# EAGLE design pro2310 (EAGLE 7.4.0)

## Sheet 1 of 6
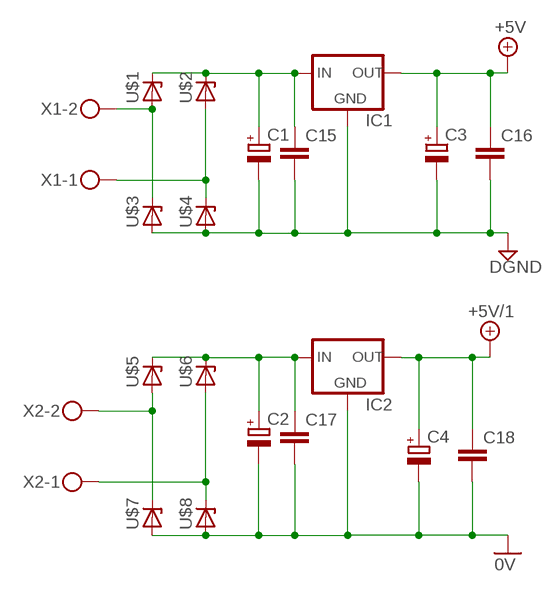
[diagram p0: schematic, sheet 1]

### Parts
C1  CPOL-EUE5-10.5  [E5-10,5]
C2  CPOL-EUE5-10.5  [E5-10,5]
C3  CPOL-EUE3.5-8  [E3,5-8]
C4  CPOL-EUE3.5-8  [E3,5-8]
C15  C-EU050-055X075  [C050-055X075]
C16  C-EU050-055X075  [C050-055X075]
C17  C-EU050-055X075  [C050-055X075]
C18  C-EU050-055X075  [C050-055X075]
IC1  78LXX  [78LXX]
IC2  78MXXL  [78MXXL]
U$1  1N4148-V  [1N4148]
U$2  1N4148-V  [1N4148]
U$3  1N4148-V  [1N4148]
U$4  1N4148-V  [1N4148]
U$5  1N4148-V  [1N4148]
U$6  1N4148-V  [1N4148]
U$7  1N4148-V  [1N4148]
U$8  1N4148-V  [1N4148]
X1  MKDSN1,5/2-5,08  [MKDSN1,5/2-5,08]
X2  MKDSN1,5/2-5,08  [MKDSN1,5/2-5,08]

### Nets
0V: C2.- C4.- C17.2 C18.2 IC2.GND U$7.A U$8.A ; also sheet 2,4,6
+5V: C3.+ C16.1 IC1.OUT ; also sheet 3
+5V/1: C4.+ C18.1 IC2.OUT ; also sheet 2
DGND: C1.- C3.- C15.2 C16.2 IC1.GND U$3.A U$4.A ; also sheet 2,3
N$5: C1.+ C15.1 IC1.IN U$1.C U$2.C
N$6: U$5.A U$7.C X2.2
N$7: U$6.A U$8.C X2.1
N$8: U$2.A U$4.C X1.1
N$9: C2.+ C17.1 IC2.IN U$5.C U$6.C
N$10: U$1.A U$3.C X1.2

## Sheet 2 of 6
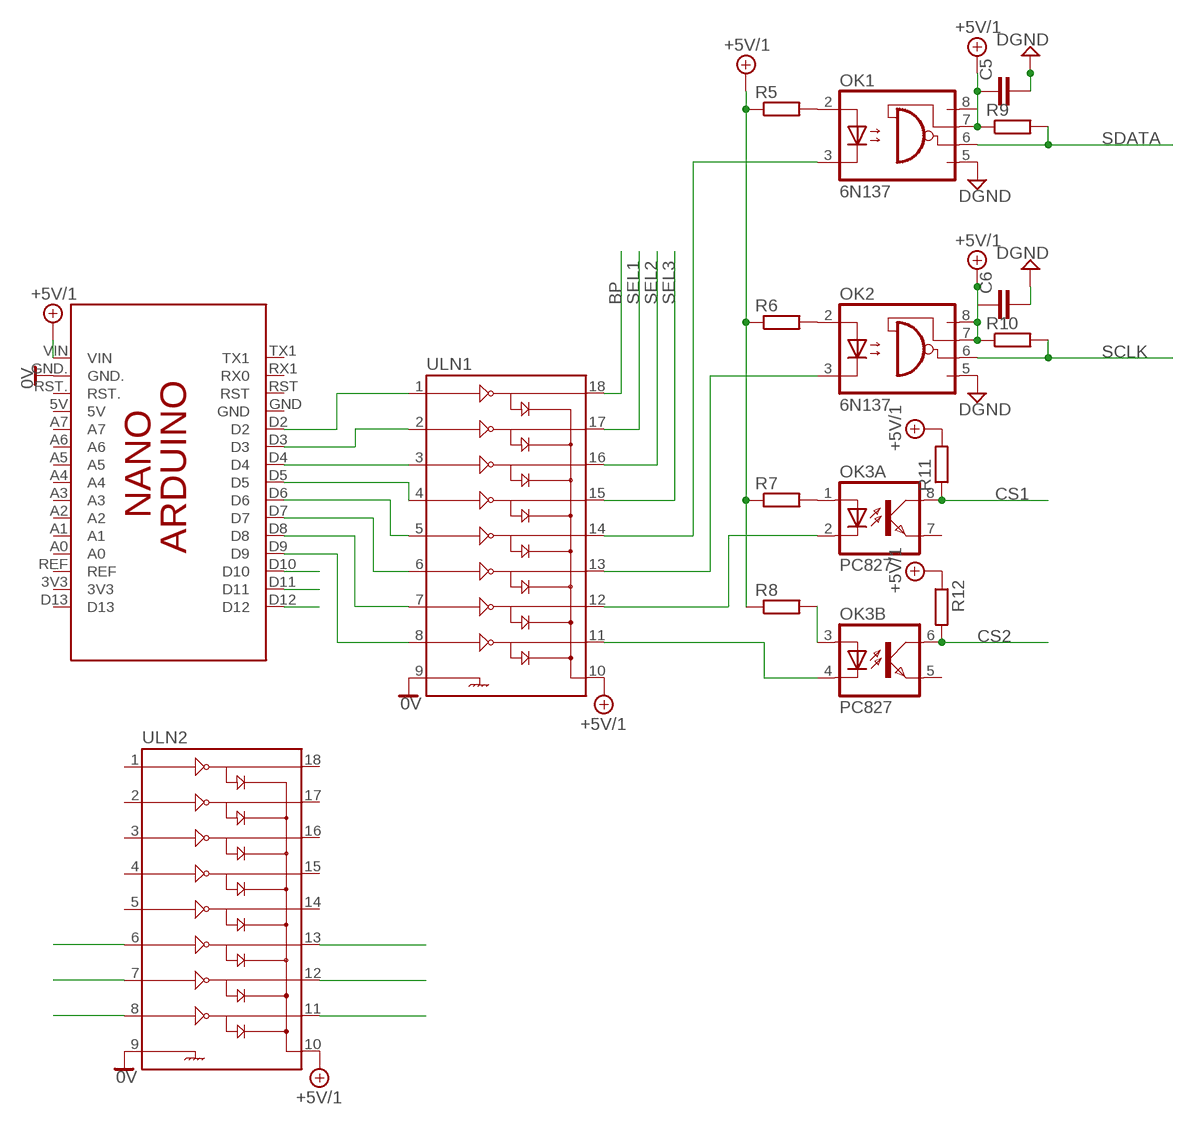
[diagram p1: schematic, sheet 2]

### Parts
C5  C-EU025-025X050  [C025-025X050]
C6  C-EU025-025X050  [C025-025X050]
OK1  6N137  [DIL08]
OK2  6N137  [DIL08]
OK3  PC827  [DIL08]
PCB1  ARDUINO_NANO  [ARDUINO_NANO]
R5  R-EU_0207/2V  [0207/2V]
R6  R-EU_0207/2V  [0207/2V]
R7  R-EU_0207/2V  [0207/2V]
R8  R-EU_0207/2V  [0207/2V]
R9  R-EU_0207/2V  [0207/2V]
R10  R-EU_0207/2V  [0207/2V]
R11  R-EU_0207/2V  [0207/2V]
R12  R-EU_0207/2V  [0207/2V]
ULN1  ULN2803DIP  [DIL18]
ULN2  ULN2803DIP  [DIL18]

### Nets
0V: PCB1.GND. ULN1.9 ULN2.9 ; also sheet 1,4,6
+5V/1: C5.1 C6.1 OK1.7(VE) OK1.8(VCC) OK2.7(VE) OK2.8(VCC) PCB1.VIN R5.1 R6.1 R7.1 R8.1 R9.1 R10.1 R11.2 R12.1 ULN1.10 ULN2.10 ; also sheet 1
BP: ULN1.18 ; also sheet 4
CS1: OK3.8(A:COL) R11.1 ; also sheet 3
CS2: OK3.6(B:COL) R12.2 ; also sheet 3
D2: PCB1.D2 ULN1.1
D3: PCB1.D3 ULN1.2
D4: PCB1.D4 ULN1.3
D5: PCB1.D5 ULN1.4
D6: PCB1.D6 ULN1.5
D7: PCB1.D7 ULN1.6
D8: PCB1.D8 ULN1.7
D9: PCB1.D9 ULN1.8
D10: PCB1.D10 ULN2.8
D11: PCB1.D11 ULN2.7
D12: PCB1.D12 ULN2.6
DGND: C5.2 C6.2 OK1.5(GND) OK2.5(GND) ; also sheet 1,3
N$17: OK1.2(A) R5.2
N$18: OK2.2(A) R6.2
N$19: OK3.1(A:A) R7.2
N$20: OK3.3(B:A) R8.2
N$21: OK1.3(C) ULN1.14
N$22: OK3.2(A:C) ULN1.12
N$23: OK3.4(B:C) ULN1.11
N$25: OK2.3(C) ULN1.13
OUT1: ULN2.13 ; also sheet 6
OUT2: ULN2.12 ; also sheet 6
OUT3: ULN2.11 ; also sheet 6
SCLK: OK2.6(VO) R10.2 ; also sheet 3
SDATA: OK1.6(VO) R9.2 ; also sheet 3
SEL1: ULN1.17 ; also sheet 4
SEL2: ULN1.16 ; also sheet 4
SEL3: ULN1.15 ; also sheet 4
Unconnected: OK3.5(B:EMIT) OK3.7(A:EMIT) PCB1.3V3 PCB1.5V PCB1.A0 PCB1.A1 PCB1.A2 PCB1.A3 PCB1.A4 PCB1.A5 PCB1.A6 PCB1.A7 PCB1.D13 PCB1.GND PCB1.REF PCB1.RST PCB1.RST. PCB1.RX1(RX0) PCB1.TX1 ULN2.1 ULN2.2 ULN2.3 ULN2.4 ULN2.5 ULN2.14 ULN2.15 ULN2.16 ULN2.17 ULN2.18

## Sheet 3 of 6
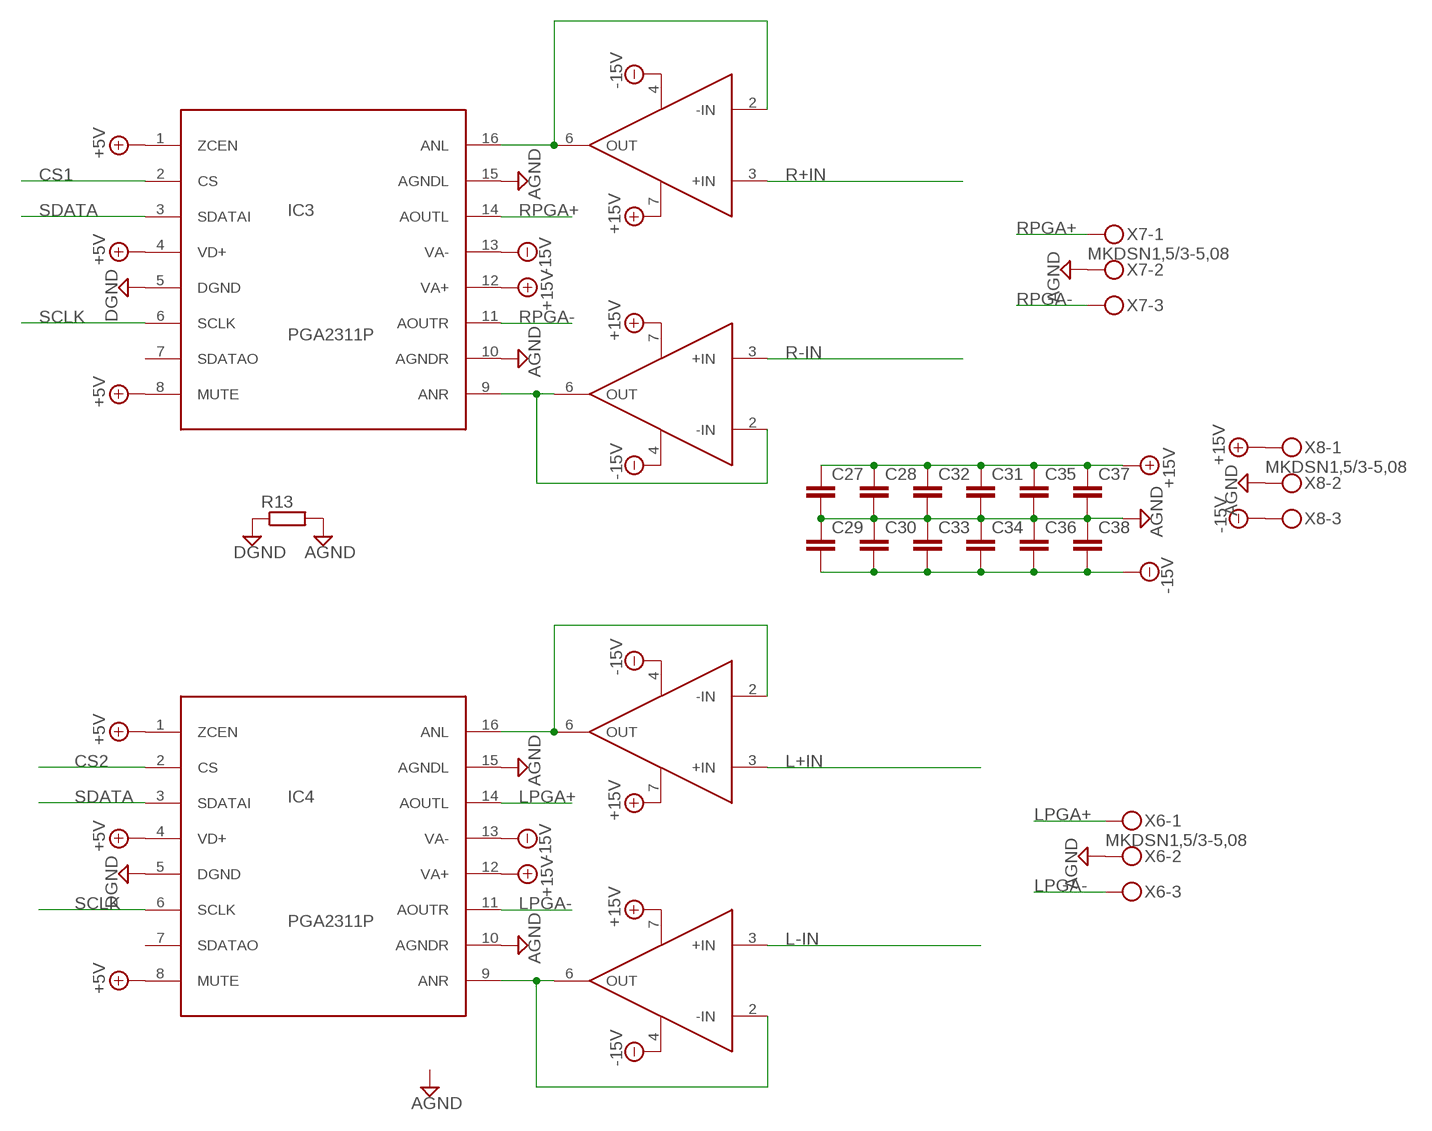
[diagram p2: schematic, sheet 3]

### Parts
C27  C-EU025-025X050  [C025-025X050]
C28  C-EU025-025X050  [C025-025X050]
C29  C-EU025-025X050  [C025-025X050]
C30  C-EU025-025X050  [C025-025X050]
C31  C-EU025-025X050  [C025-025X050]
C32  C-EU025-025X050  [C025-025X050]
C33  C-EU025-025X050  [C025-025X050]
C34  C-EU025-025X050  [C025-025X050]
C35  C-EU025-025X050  [C025-025X050]
C36  C-EU025-025X050  [C025-025X050]
C37  C-EU025-025X050  [C025-025X050]
C38  C-EU025-025X050  [C025-025X050]
IC3  PGA2311P  [DIL16]
IC4  PGA2311P  [DIL16]
R13  R-EU_0207/7  [0207/7]
U1  OPA627BP  [DIL08]
U2  OPA627BP  [DIL08]
U3  OPA627BP  [DIL08]
U4  OPA627BP  [DIL08]
X6  MKDSN1,5/3-5,08  [MKDSN1,5/3-5,08]
X7  MKDSN1,5/3-5,08  [MKDSN1,5/3-5,08]
X8  MKDSN1,5/3-5,08  [MKDSN1,5/3-5,08]

### Nets
+5V: IC3.1(ZCEN) IC3.4(VD+) IC3.8(MUTE) IC4.1(ZCEN) IC4.4(VD+) IC4.8(MUTE) ; also sheet 1
+15V: C27.1 C28.1 C31.1 C32.1 C35.1 C37.1 IC3.12(VA+) IC4.12(VA+) U1.7(V+) U2.7(V+) U3.7(V+) U4.7(V+) X8.1
-15V: C29.2 C30.2 C33.2 C34.2 C36.2 C38.2 IC3.13(VA-) IC4.13(VA-) U1.4(V-) U2.4(V-) U3.4(V-) U4.4(V-) X8.3
AGND: C27.2 C28.2 C29.1 C30.1 C31.2 C32.2 C33.1 C34.1 C35.2 C36.1 C37.2 C38.1 IC3.10(AGNDR) IC3.15(AGNDL) IC4.10(AGNDR) IC4.15(AGNDL) R13.2 X6.2 X7.2 X8.2 ; also sheet 4
CS1: IC3.2(CS) ; also sheet 2
CS2: IC4.2(CS) ; also sheet 2
DGND: IC3.5(DGND) IC4.5(DGND) R13.1 ; also sheet 1,2
L+IN: U3.3(+IN) ; also sheet 4
L-IN: U4.3(+IN) ; also sheet 4
LPGA+: IC4.14(AOUTL) X6.1 ; also sheet 4
LPGA-: IC4.11(AOUTR) X6.3 ; also sheet 4
N$1: IC3.9(ANR) U2.2(-IN) U2.6(OUT)
N$2: IC3.16(ANL) U1.2(-IN) U1.6(OUT)
N$3: IC4.9(ANR) U4.2(-IN) U4.6(OUT)
N$15: IC4.16(ANL) U3.2(-IN) U3.6(OUT)
R+IN: U1.3(+IN) ; also sheet 4
R-IN: U2.3(+IN) ; also sheet 4
RPGA+: IC3.14(AOUTL) X7.1 ; also sheet 4
RPGA-: IC3.11(AOUTR) X7.3 ; also sheet 4
SCLK: IC3.6(SCLK) IC4.6(SCLK) ; also sheet 2
SDATA: IC3.3(SDATAI) IC4.3(SDATAI) ; also sheet 2
Unconnected: IC3.7(SDATAO) IC4.7(SDATAO)

## Sheet 4 of 6
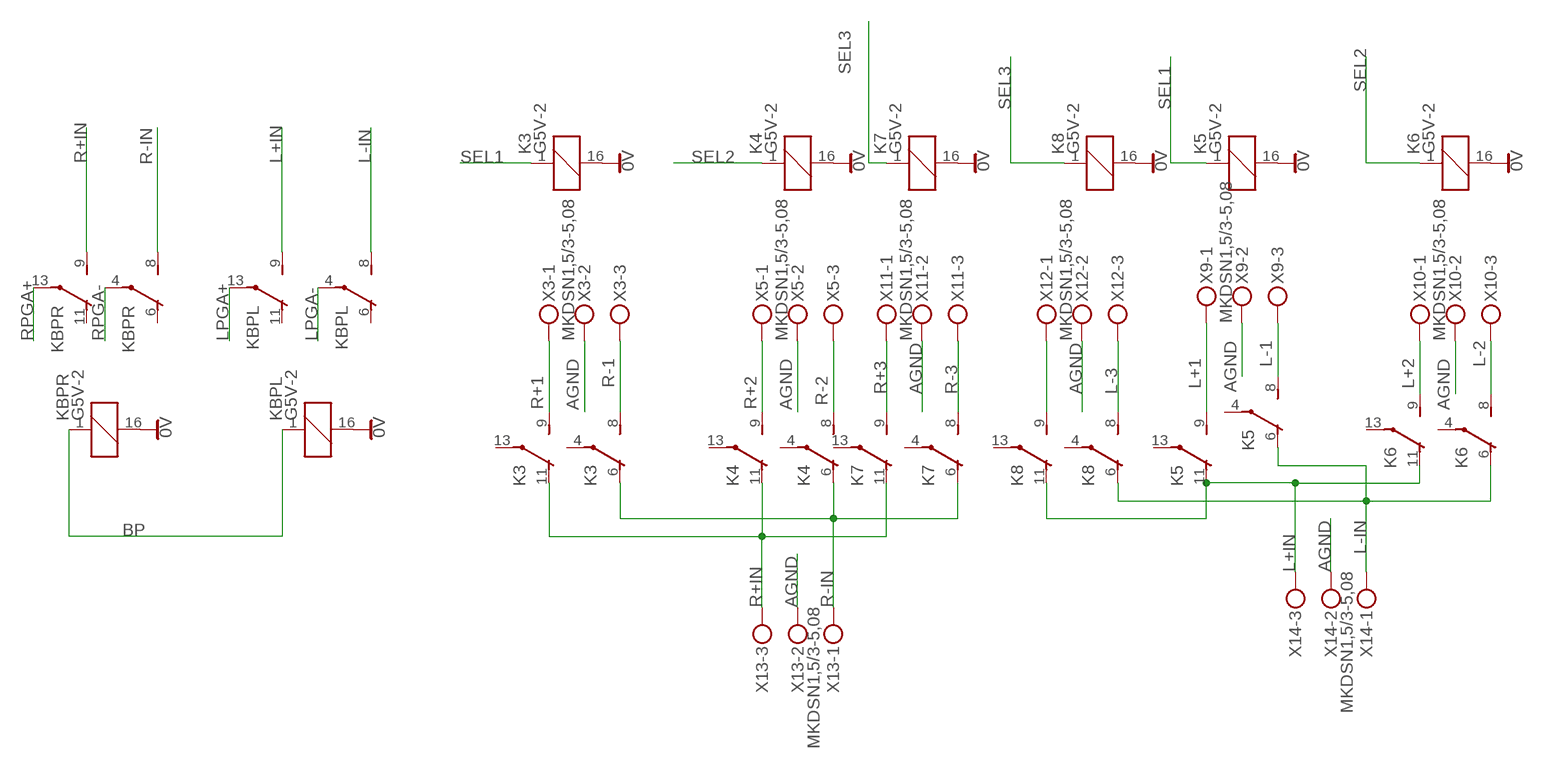
[diagram p3: schematic, sheet 4]

### Parts
K3  G5V-2  [G5V-2]
K4  G5V-2  [G5V-2]
K5  G5V-2  [G5V-2]
K6  G5V-2  [G5V-2]
K7  G5V-2  [G5V-2]
K8  G5V-2  [G5V-2]
KBPL  G5V-2  [G5V-2]
KBPR  G5V-2  [G5V-2]
X3  MKDSN1,5/3-5,08  [MKDSN1,5/3-5,08]
X5  MKDSN1,5/3-5,08  [MKDSN1,5/3-5,08]
X9  MKDSN1,5/3-5,08  [MKDSN1,5/3-5,08]
X10  MKDSN1,5/3-5,08  [MKDSN1,5/3-5,08]
X11  MKDSN1,5/3-5,08  [MKDSN1,5/3-5,08]
X12  MKDSN1,5/3-5,08  [MKDSN1,5/3-5,08]
X13  MKDSN1,5/3-5,08  [MKDSN1,5/3-5,08]
X14  MKDSN1,5/3-5,08  [MKDSN1,5/3-5,08]

### Nets
0V: K3.16 K4.16 K5.16 K6.16 K7.16 K8.16 KBPL.16 KBPR.16 ; also sheet 1,2,6
AGND: X3.2 X5.2 X9.2 X10.2 X11.2 X12.2 X13.2 X14.2 ; also sheet 3
BP: KBPL.1 KBPR.1 ; also sheet 2
L+1: K5.9(2:S) X9.1
L+2: K6.9(2:S) X10.1
L+3: K8.9(2:S) X12.1
L+IN: K5.11(2:O) K6.11(2:O) K8.11(2:O) KBPL.9(2:S) X14.3 ; also sheet 3
L-1: K5.8(1:S) X9.3
L-2: K6.8(1:S) X10.3
L-3: K8.8(1:S) X12.3
L-IN: K5.6(1:O) K6.6(1:O) K8.6(1:O) KBPL.8(1:S) X14.1 ; also sheet 3
LPGA+: KBPL.13(2:P) ; also sheet 3
LPGA-: KBPL.4(1:P) ; also sheet 3
R+1: K3.9(2:S) X3.1
R+2: K4.9(2:S) X5.1
R+3: K7.9(2:S) X11.1
R+IN: K3.11(2:O) K4.11(2:O) K7.11(2:O) KBPR.9(2:S) X13.3 ; also sheet 3
R-1: K3.8(1:S) X3.3
R-2: K4.8(1:S) X5.3
R-3: K7.8(1:S) X11.3
R-IN: K3.6(1:O) K4.6(1:O) K7.6(1:O) KBPR.8(1:S) X13.1 ; also sheet 3
RPGA+: KBPR.13(2:P) ; also sheet 3
RPGA-: KBPR.4(1:P) ; also sheet 3
SEL1: K3.1 K5.1 ; also sheet 2
SEL2: K4.1 K6.1 ; also sheet 2
SEL3: K7.1 K8.1 ; also sheet 2
Unconnected: K3.4(1:P) K3.13(2:P) K4.4(1:P) K4.13(2:P) K5.4(1:P) K5.13(2:P) K6.4(1:P) K6.13(2:P) K7.4(1:P) K7.13(2:P) K8.4(1:P) K8.13(2:P) KBPL.6(1:O) KBPL.11(2:O) KBPR.6(1:O) KBPR.11(2:O)

## Sheet 5 of 6
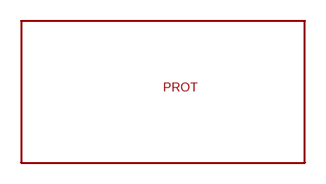
[diagram p4: schematic, sheet 5]

### Parts
U$15  PROT  [PROT]

## Sheet 6 of 6
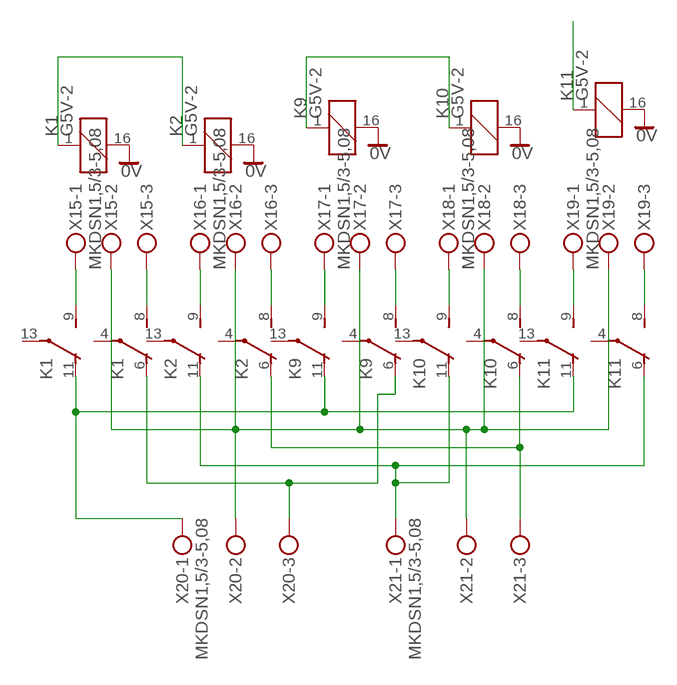
[diagram p5: schematic, sheet 6]

### Parts
K1  G5V-2  [G5V-2]
K2  G5V-2  [G5V-2]
K9  G5V-2  [G5V-2]
K10  G5V-2  [G5V-2]
K11  G5V-2  [G5V-2]
X15  MKDSN1,5/3-5,08  [MKDSN1,5/3-5,08]
X16  MKDSN1,5/3-5,08  [MKDSN1,5/3-5,08]
X17  MKDSN1,5/3-5,08  [MKDSN1,5/3-5,08]
X18  MKDSN1,5/3-5,08  [MKDSN1,5/3-5,08]
X19  MKDSN1,5/3-5,08  [MKDSN1,5/3-5,08]
X20  MKDSN1,5/3-5,08  [MKDSN1,5/3-5,08]
X21  MKDSN1,5/3-5,08  [MKDSN1,5/3-5,08]

### Nets
0V: K1.16 K2.16 K9.16 K10.16 K11.16 ; also sheet 1,2,4
GOUT: X15.2 X16.2 X17.2 X18.2 X19.2 X20.2 X21.2
LOUT+: K2.11(2:O) K10.11(2:O) K11.6(1:O) X21.1
LOUT-: K2.6(1:O) K10.6(1:O) X21.3
N$24: K1.8(1:S) X15.3
N$26: K1.9(2:S) X15.1
N$27: K2.9(2:S) X16.1
N$28: K2.8(1:S) X16.3
N$29: K9.9(2:S) X17.1
N$30: K9.8(1:S) X17.3
N$31: K10.9(2:S) X18.1
N$32: K10.8(1:S) X18.3
N$33: K11.9(2:S) X19.1
N$34: K11.8(1:S) X19.3
OUT1: K1.1 K2.1 ; also sheet 2
OUT2: K9.1 K10.1 ; also sheet 2
OUT3: K11.1 ; also sheet 2
ROUT+: K1.11(2:O) K9.11(2:O) K11.11(2:O) X20.1
ROUT-: K1.6(1:O) K9.6(1:O) X20.3
Unconnected: K1.4(1:P) K1.13(2:P) K2.4(1:P) K2.13(2:P) K9.4(1:P) K9.13(2:P) K10.4(1:P) K10.13(2:P) K11.4(1:P) K11.13(2:P)

## Library data of the parts
C1-C4 = Vwvwbg:CPOL-EU: POLARIZED CAPACITOR, European symbol
C5 C6 C15-C18 C27-C38 = Vwvwbg:C-EU: CAPACITOR, European symbol
IC1 = v-reg:78LXX: VOLTAGE REGULATOR
IC2 = v-reg:78MXXL: VOLTAGE REGULATOR
IC3 IC4 = Vwvwbg:PGA2311
K1-K11 KBPL KBPR = relay:G5V-2: OMRON PCB Relay Source: http://www.omron.com/ecb/products/pdf/en-g5v2.pdf; MPN: G5V-2 5DC; OC_FARNELL: 9949488; OC_NEWARK: 78K5703
OK1 OK2 = optocoupler:6N137: MOTOROLA OPTO COUPLER; MPN: 6N137; OC_FARNELL: 1328376; OC_NEWARK: 52M1895
OK3 = optocoupler:PC827: SHARP OPTO COUPLER; OC_FARNELL: unknown; OC_NEWARK: unknown
PCB1 = E14_Arduino_revB:ARDUINO_NANO: Device for representing an Arduino Nano board with a footprint in an EAGLE design. Created by Dave Young for Element14. More EAGLE documentation at: http://www.element14.com/community/community/knode/cadsoft_eagle
R5-R13 = Vwvwbg:R-EU_: RESISTOR, European symbol
U1-U4 = Vwvwbg:OPA627BP: OPERATIONAL AMPLIFIER
U$1-U$8 = diode:1N4148-V
U$15 = Vwvwbg:PROT
ULN1 ULN2 = SparkFun-PowerIC:ULN2803: Darlington Driver ULN2803 Darlington array. 500mA max per channel, 8-channel package. Spark Fun Electronics SKU : COM-00312
X1 X2 = con-phoenix-508:MKDSN1,5/2-5,08: MKDSN 1,5/ 2-5,08 Printklemme Nennstrom: 13,5 A Nennspannung: 250 V Rastermaß: 5,08 mm Polzahl: 2 Anschlussart: Schraubanschluss Montage: Löten Anschlussrichtung Leiter/Platine: 0 ° Artikelnummer: 1729128 Source: http://eshop.phoenixcontact.com .. 1729128.pdf
X3 X5-X21 = con-phoenix-508:MKDSN1,5/3-5,08: MKDSN 1,5/ 3-5,08 Printklemme Nennstrom: 13,5 A Nennspannung: 250 V Rastermaß: 5,08 mm Polzahl: 3 Anschlussart: Schraubanschluss Montage: Löten Anschlussrichtung Leiter/Platine: 0 ° Artikelnummer: 1729131 Source: http://eshop.phoenixcontact.com .. 1729131.pdf

## Board
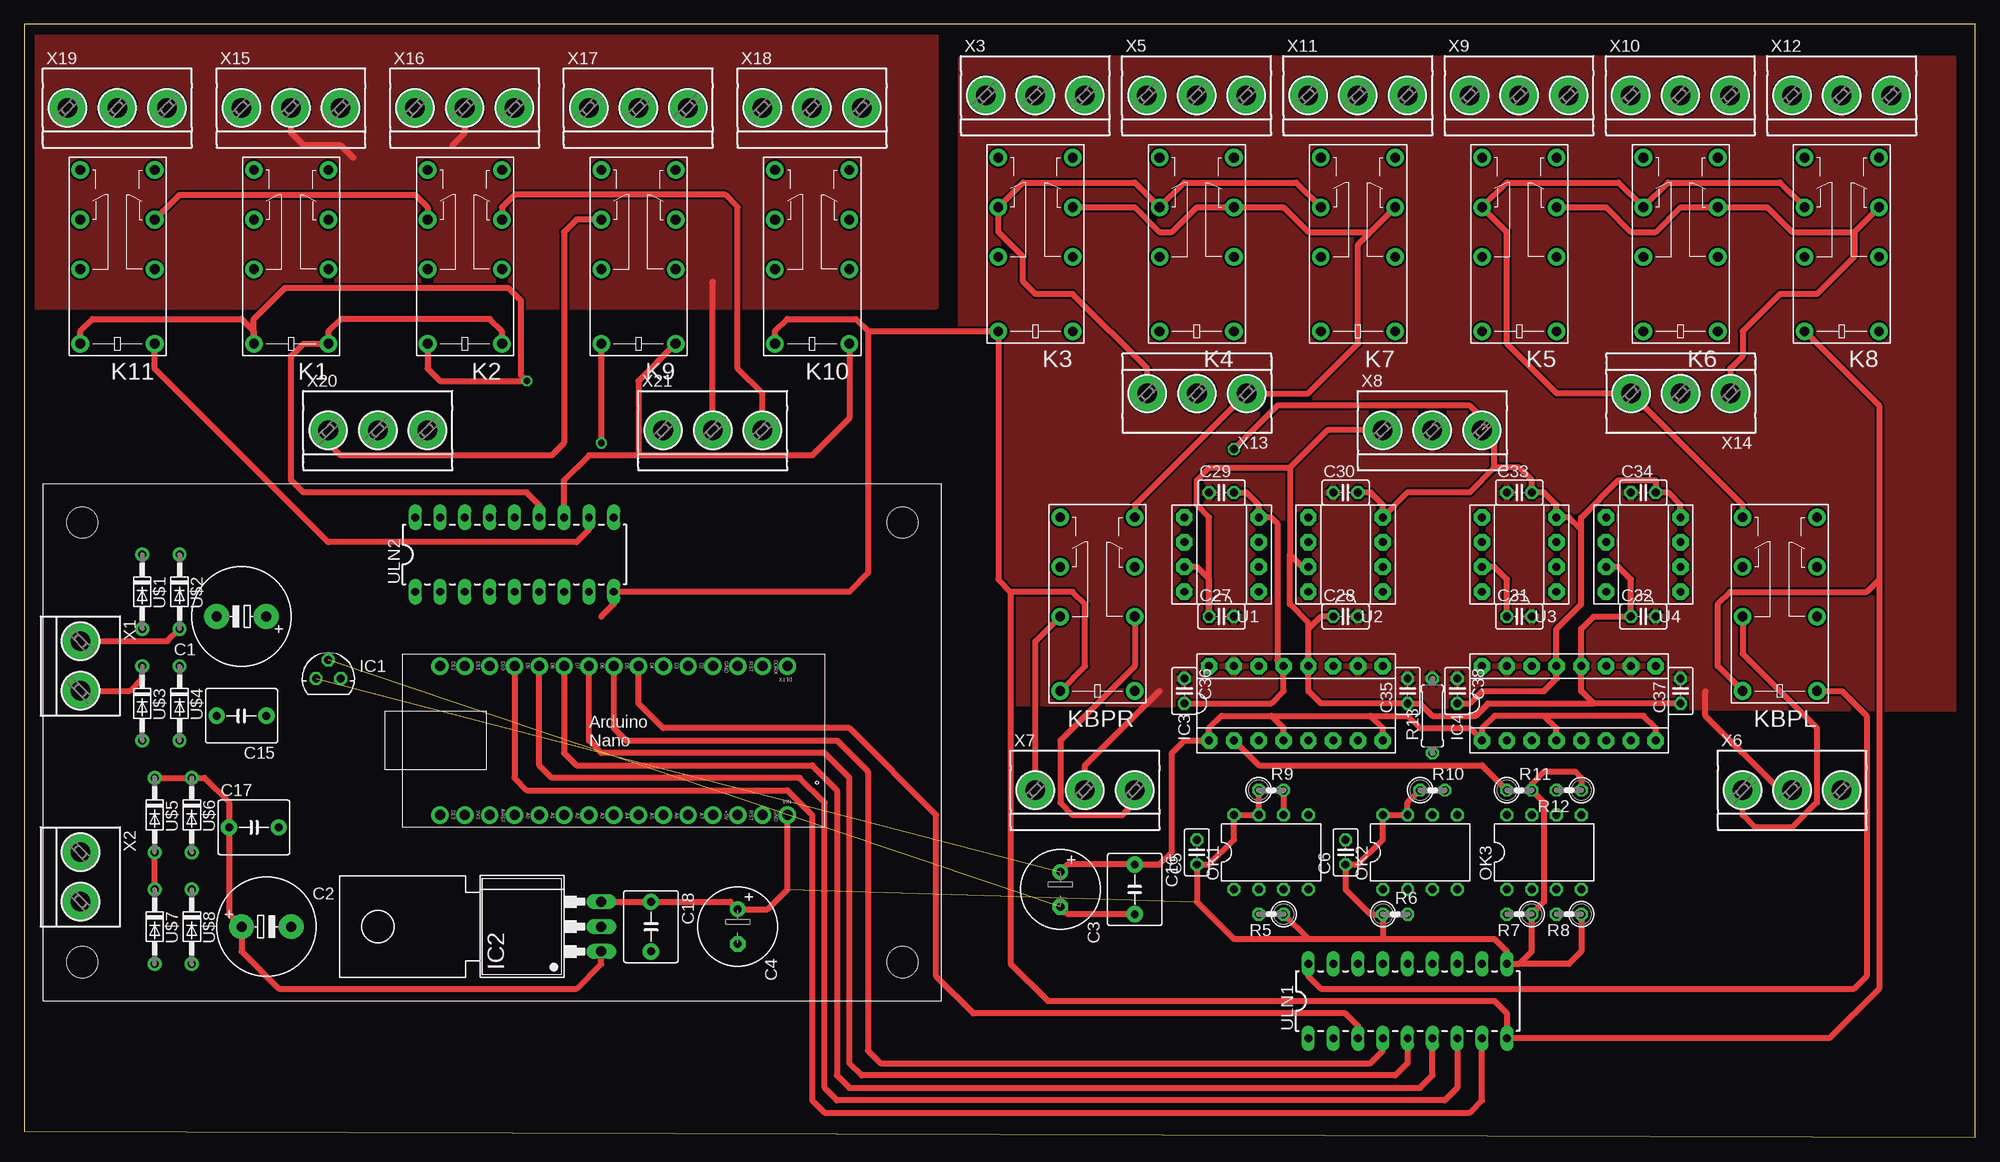
[diagram p6: board, top side]
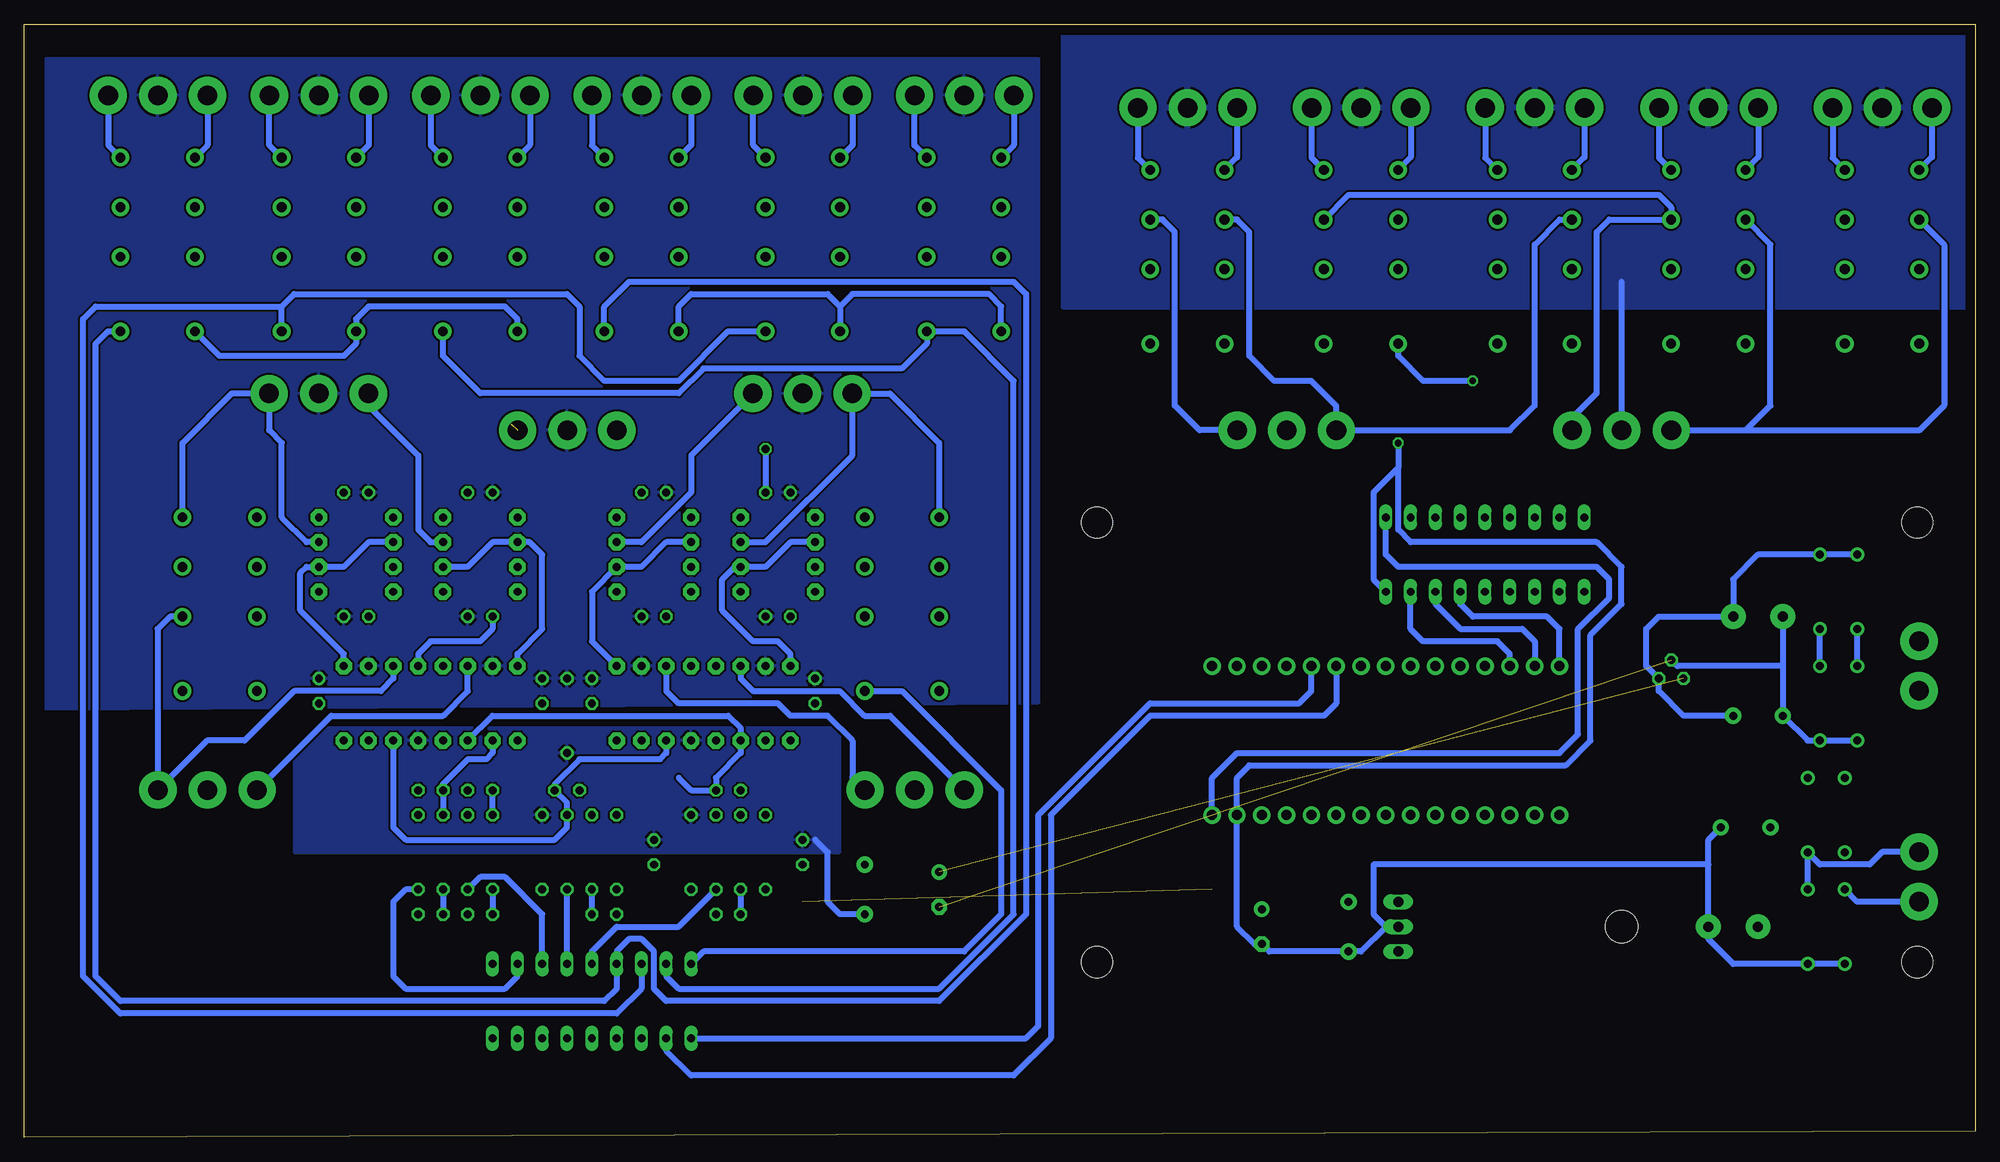
[diagram p7: board, bottom side, seen from below]

Size 199.69 x 113.97 mm. Coordinates in mm from the lower left corner, seen from the top.
Outline: 0,0.64 199.69,0 199.69,113.97 0,113.97 0,0.64
Copper layers (1*16): Top 0.035mm / dielectric 1.5mm / Bottom 0.035mm
Design rules "default": minimum track width 10mil, minimum drill 24mil, track to track 8mil, track to pad 8mil, pad to pad 8mil, via to via 8mil, smd to smd 8mil, copper to edge 40mil, drill to drill 8mil, minimum pad ring 10mil, minimum via ring 8mil, stop-mask expansion 4mil, vias tented up to drill 0mil, thermal gap 10mil

### Footprints (pad centres in the part's own frame; a part is rotated, then mirrored left to right if it is on the bottom)
E5-10,5 = drill 1.016 pad 2.54: + -2.54,0; - 2.54,0
E3,5-8 = drill 0.813 pad 1.6: + -1.778,0 | drill 0.813 pad 1.6 octagon: - 1.778,0
C025-025X050 = drill 0.813 octagon: 1 -1.27,0; 2 1.27,0
C050-055X075 = drill 0.813 pad 1.676: 1 -2.54,0; 2 2.54,0
78LXX = drill 0.813 octagon: GND 0,1.905; IN 1.27,0; OUT -1.27,0
78MXXL = drill 1.016 long: GND 0,-5.08; IN -2.54,-5.08; OUT 2.54,-5.08 | hole 3.302: 0,17.78
DIL16 = drill 0.813 pad 1.676 octagon: 1 -8.89,-3.81; 2 -6.35,-3.81; 3 -3.81,-3.81; 4 -1.27,-3.81; 5 1.27,-3.81; 6 3.81,-3.81; 7 6.35,-3.81; 8 8.89,-3.81; 9 8.89,3.81; 10 6.35,3.81; 11 3.81,3.81; 12 1.27,3.81; 13 -1.27,3.81; 14 -3.81,3.81; 15 -6.35,3.81; 16 -8.89,3.81
G5V-2 = drill 1 pad 1.8: 1 -8.89,-3.81; 4 -1.27,-3.81; 6 3.81,-3.81; 8 8.89,-3.81; 9 8.89,3.81; 11 3.81,3.81; 13 -1.27,3.81; 16 -8.89,3.81
DIL08 = drill 0.813 octagon: 1 -3.81,-3.81; 2 -1.27,-3.81; 3 1.27,-3.81; 4 3.81,-3.81; 5 3.81,3.81; 6 1.27,3.81; 7 -1.27,3.81; 8 -3.81,3.81
ARDUINO_NANO = drill 1.016 pad 1.778: 3V3 6.35,1.27; 5V 31.75,1.27; A0 11.43,1.27; A1 13.97,1.27; A2 16.51,1.27; A3 19.05,1.27; A4 21.59,1.27; A5 24.13,1.27; A6 26.67,1.27; A7 29.21,1.27; D2 29.21,16.51; D3 26.67,16.51; D4 24.13,16.51; D5 21.59,16.51; D6 19.05,16.51; D7 16.51,16.51; D8 13.97,16.51; D9 11.43,16.51; D10 8.89,16.51; D11 6.35,16.51; D12 3.81,16.51; D13 3.81,1.27; GND 31.75,16.51; GND. 36.83,1.27; REF 8.89,1.27; RST 34.29,16.51; RST. 34.29,1.27; RX1 36.83,16.51; TX1 39.37,16.51; VIN 39.37,1.27
0207/2V = drill 0.813 octagon: 1 -1.27,0; 2 1.27,0
0207/7 = drill 0.813 octagon: 1 -3.81,0; 2 3.81,0
DIL08' = drill 0.813 pad 1.676 octagon: 1 -3.81,-3.81; 2 -1.27,-3.81; 3 1.27,-3.81; 4 3.81,-3.81; 5 3.81,3.81; 6 1.27,3.81; 7 -1.27,3.81; 8 -3.81,3.81
1N4148 = drill 0.813 pad 1.422: A 3.81,0; C -3.81,0
PROT = hole 3.2: 4,4; 88,49; 88,4; 4,49
DIL18 = drill 0.813 long: 1 -10.16,-3.81; 2 -7.62,-3.81; 3 -5.08,-3.81; 4 -2.54,-3.81; 5 0,-3.81; 6 2.54,-3.81; 7 5.08,-3.81; 8 7.62,-3.81; 9 10.16,-3.81; 10 10.16,3.81; 11 7.62,3.81; 12 5.08,3.81; 13 2.54,3.81; 14 0,3.81; 15 -2.54,3.81; 16 -5.08,3.81; 17 -7.62,3.81; 18 -10.16,3.81
MKDSN1,5/2-5,08 = drill 2 pad 3.81: 1 -2.561,0.025; 2 2.519,0.025
MKDSN1,5/3-5,08 = drill 2 pad 3.81: 1 -7.641,0.025; 2 -2.561,0.025; 3 2.519,0.025

### Placement (x,y rotation side)
C1  22.23,53.34 180 top
C2  24.77,21.59 0 top
C3  106.05,25.4 270 top
C4  73.03,21.59 270 top
C5  120.02,29.21 90 top
C6  135.25,29.21 90 top
C15  22.23,43.18 180 top
C16  113.67,25.4 270 top
C17  23.5,31.75 0 top
C18  64.14,21.59 270 top
C27  122.56,53.34 0 top
C28  135.25,53.34 0 top
C29  122.56,66.04 0 top
C30  135.25,66.04 0 top
C31  153.03,53.34 0 top
C32  165.74,53.34 0 top
C33  153.03,66.04 0 top
C34  165.74,66.04 0 top
C35  141.6,45.72 90 top
C36  118.75,45.72 270 top
C37  169.54,45.72 90 top
C38  146.69,45.72 270 top
IC1  31.11,46.99 0 top
IC2  53.98,21.59 90 top
IC3  130.18,44.45 0 top
IC4  158.12,44.45 0 top
K1  27.3,90.17 90 top
K2  45.09,90.17 90 top
K3  103.5,91.44 90 top
K4  120.02,91.44 90 top
K5  153.03,91.44 90 top
K6  169.54,91.44 90 top
K7  136.53,91.44 90 top
K8  186.06,91.44 90 top
K9  62.87,90.17 90 top
K10  80.64,90.17 90 top
K11  9.53,90.17 90 top
KBPL  179.71,54.61 90 top
KBPR  109.86,54.61 90 top
OK1  127.64,29.21 0 top
OK2  142.88,29.21 0 top
OK3  155.57,29.21 0 top
PCB1  38.73,31.75 0 top
R5  127.64,22.86 180 top
R6  140.34,22.86 0 top
R7  153.03,22.86 180 top
R8  158.12,22.86 180 top
R9  127.64,35.56 0 top
R10  144.15,35.56 0 top
R11  153.03,35.56 0 top
R12  158.12,35.56 180 top
R13  144.15,43.18 90 top
U1  OPA627BP  [DIL08']  122.56,59.69 90 top
U2  OPA627BP  [DIL08']  135.25,59.69 90 top
U3  OPA627BP  [DIL08']  153.03,59.69 90 top
U4  OPA627BP  [DIL08']  165.74,59.69 90 top
U$1  12.06,55.88 270 top
U$2  15.88,55.88 270 top
U$3  12.06,44.45 270 top
U$4  15.88,44.45 270 top
U$5  13.34,33.02 270 top
U$6  17.14,33.02 270 top
U$7  13.34,21.59 270 top
U$8  17.14,21.59 270 top
U$15  1.91,13.97 0 top
ULN1  141.6,13.97 0 top
ULN2  50.16,59.69 0 top
X1  5.71,48.26 270 top
X2  5.71,26.67 270 top
X3  106.05,106.68 0 top
X5  122.56,106.68 0 top
X6  183.51,35.56 0 top
X7  111.12,35.56 0 top
X8  146.69,72.39 0 top
X9  155.57,106.68 0 top
X10  172.09,106.68 0 top
X11  139.06,106.68 0 top
X12  188.59,106.68 0 top
X13  117.47,76.2 180 top
X14  167,76.2 180 top
X15  29.84,105.41 0 top
X16  47.62,105.41 0 top
X17  65.41,105.41 0 top
X18  83.19,105.41 0 top
X19  12.06,105.41 0 top
X20  38.73,72.39 0 top
X21  73.03,72.39 0 top

### Tracks (layer width: path | path; a pad name or v marks a point on that pad's centre or on a via)
0V  (via drill 0.7 pad 0.61, 0.7 pad 0.81)
  Top 0.61: K8.16 189.87,74.93 189.87,57.15 | 189.87,57.15 189.87,15.24 184.78,10.16 ULN1.9 151.76,12.7 150.5,13.97 104.78,13.97 100.97,17.78 100.97,55.88 | 100.97,55.88 99.69,57.15 K3.16 86.36,82.55 | KBPL.16 173.35,48.26 173.35,54.61 174.62,55.88 188.59,55.88 189.87,57.15 | KBPR.16 108.58,48.26 108.58,54.61 107.31,55.88 100.97,55.88 | K11.16 5.71,82.55 6.99,83.82 22.23,83.82 23.5,82.55 K1.16 23.5,83.82 26.67,87 49.53,87 50.8,85.73 50.8,78.11 v51.44,77.47 42.55,77.47 41.27,78.74 K2.16 | 59.05,53.34 60.33,54.61 ULN2.9 84.45,55.88 86.36,57.78 86.36,82.55 | K9.16 v59.05,71.12 | K10.16 76.83,82.55 78.11,83.82 85.09,83.82 86.36,82.55
  Bottom 0.61: K3.16 99.69,85.09 100.97,86.36 114.94,86.36 116.2,85.09 | 116.2,85.09 K4.16 | K7.16 132.72,85.09 131.44,86.36 117.47,86.36 116.2,85.09 | K5.16 149.22,83.82 150.5,85.09 164.47,85.09 165.74,83.82 K6.16 165.74,81.28 167,80.01 179.71,80.01 K8.16 | v51.44,77.47 56.52,77.47 59.05,80.01 K9.16 | v59.05,71.12 59.05,68.58 | 59.05,68.58 61.59,66.04 61.59,57.15 ULN2.9 | U$7.A U$8.A 24.77,17.78 27.3,20.32 C2.- 27.3,27.94 | 27.3,27.94 27.3,30.48 C17.2 | 27.3,27.94 61.59,27.94 61.59,22.86 60.33,21.59 | IC2.GND 60.33,21.59 | 60.33,21.59 62.87,19.05 C18.2 72.26,19.05 C4.- 73.79,19.81 75.56,21.59 PCB1.GND. 75.56,36.83 74.3,38.1 41.91,38.1 39.37,40.64 39.37,51.43 36.2,54.61 36.2,58.42 38.73,60.96 57.78,60.96 59.05,62.23 59.05,68.58
+5V  (1 unrouted)
  Top 0.61: 127.64,43.18 122.56,43.18 121.28,41.91 IC3.1 118.75,40.64 117.47,39.37 117.47,29.21 116.2,27.94 C16.1 106.81,27.94 C3.+ | 127.64,43.18 137.79,43.18 | 137.79,43.18 141.6,43.18 142.88,41.91 147.96,41.91 IC4.1 149.22,41.91 150.5,43.18 155.57,43.18 | IC4.8 167,41.91 165.74,43.18 155.57,43.18 | IC4.4 156.84,41.91 155.57,43.18 | IC3.4 128.91,41.91 127.64,43.18 | IC3.8 139.06,41.91 137.79,43.18
+5V/1  (1 unrouted)
  Top 0.61: R5.1 131.44,20.32 | 131.44,20.32 139.06,20.32 | 139.06,20.32 150.5,20.32 151.76,19.05 ULN1.10 153.03,17.78 | 139.06,20.32 R6.1 137.79,22.86 135.25,25.4 C6.1 136.53,27.94 139.06,30.48 OK2.8 OK2.7 141.6,34.29 R10.1 | 131.44,20.32 123.83,20.32 120.02,24.13 C5.1 121.28,27.94 123.83,30.48 OK1.8 OK1.7 R9.1 | 153.03,17.78 154.31,19.05 R7.1 155.57,24.13 155.57,34.29 R11.2 154.31,36.2 155.57,37.46 158.75,37.46 159.38,36.83 R12.1 | R8.1 159.38,19.05 158.12,17.78 153.03,17.78 | IC2.OUT C18.1 72.26,24.13 C4.+ 76.07,23.37 78.11,25.4 PCB1.VIN
  Bottom 0.61: PCB1.VIN 78.11,36.83 75.56,39.37 42.55,39.37 40.64,41.27 40.64,52.07 37.47,55.24 37.47,57.15 38.73,58.42 59.05,58.42 60.33,59.69 ULN2.10
+15V
  Top 0.61: C31.1 151.76,57.15 150.5,58.42 U3.7 | U4.7 163.19,58.42 164.47,57.15 C32.1 160.66,53.34 159.38,52.07 IC4.12 159.38,45.72 160.66,44.45 | U1.7 120.02,58.42 121.28,57.15 C27.1 121.28,63.5 120.02,64.77 120.02,67.31 121.28,68.58 129.54,68.58 | C37.1 160.66,44.45 | 131.44,52.07 IC3.12 131.44,45.72 132.72,44.45 C35.1 142.88,44.45 144.15,43.18 148.59,43.18 149.86,44.45 160.66,44.45 | 129.54,68.58 129.54,59.69 | 129.54,59.69 130.81,58.42 U2.7 | C28.1 132.72,53.34 131.44,52.07 | 131.44,52.07 131.44,52.7 129.54,54.61 129.54,59.69 | X8.1 133.38,72.42 129.54,68.58
  Bottom 0.61: C31.1 151.76,52.07 153.03,50.8 158.12,50.8 159.38,49.53 IC4.12
-15V  (via drill 0.8 pad 0.81)  (1 unrouted)
  Top 0.61: U4.4 169.54,64.77 168.28,66.04 C34.2 167,67.31 163.19,67.31 159.38,63.5 159.38,62.23 | C30.2 137.79,66.04 139.06,64.77 U2.4 141.6,66.04 147.96,66.04 150.5,68.58 | C29.2 125.09,66.04 126.36,64.77 U1.4 127.64,63.5 128.27,62.86 128.27,48.89 IC3.13 128.91,45.72 127.64,44.45 C36.2 | 159.38,62.23 159.38,54.61 156.84,52.07 IC4.13 156.84,46.99 155.57,45.72 149.22,45.72 147.96,44.45 C38.2 | 159.38,62.23 158.12,63.5 U3.4 156.84,64.77 155.57,66.04 C33.2 154.31,67.31 153.03,68.58 150.5,68.58 | 150.5,68.58 150.5,71.12 X8.3 | 149.86,73.03 147.96,74.93 128.27,74.93 v123.83,70.48
  Bottom 0.61: v123.83,70.48 C29.2
AGND
  Top 0.61: X6.2 179.68,35.59 172.09,43.18 172.09,45.72 | X7.2 108.56,38.08 116.2,45.72
  pour Bottom: 95.89,44.45 197.49,43.81 197.49,110.49 95.89,110.49
  pour Top: 95.89,110.49 197.49,110.49 197.49,43.81 95.89,44.45
BP
  Top 0.61: KBPL.1 186.06,45.72 188.59,43.18 188.59,16.51 187.32,15.24 132.72,15.24 131.44,16.51 ULN1.18
  Bottom 0.61: KBPR.1 109.86,45.72 99.69,35.56 99.69,22.86 103.5,19.05 130.18,19.05 ULN1.18
CS1
  Top 0.61: IC3.2 126.36,38.1 149.22,38.1 R11.1
  Bottom 0.61: OK3.8 R11.1
CS2
  Bottom 0.61: OK3.6 R12.2 156.84,36.2 154.31,38.73 152.4,38.73 151.76,39.37 IC4.2
D2
  Bottom 0.61: ULN1.1 97.16,10.16 95.89,11.43 95.89,33.02 84.45,44.45 69.22,44.45 67.94,45.72 PCB1.D2
D3
  Bottom 0.61: PCB1.D3 65.41,44.45 66.67,43.18 84.45,43.18 94.61,33.02 94.61,10.16 98.42,6.35 131.44,6.35 133.99,8.89 ULN1.2
D4
  Top 0.61: ULN1.3 136.53,11.43 135.25,12.7 97.16,12.7 93.34,16.51 93.34,33.02 84.45,41.91 65.41,41.91 62.87,44.45 PCB1.D4
D5
  Top 0.61: PCB1.D5 60.33,41.91 61.59,40.64 83.19,40.64 86.36,37.46 86.36,8.89 87.63,7.62 137.79,7.62 139.06,8.89 ULN1.4
D6
  Top 0.61: ULN1.5 141.6,7.62 140.34,6.35 85.72,6.35 84.45,7.62 84.45,36.83 81.92,39.37 59.05,39.37 57.78,40.64 PCB1.D6
D7
  Top 0.61: PCB1.D7 55.24,39.37 56.52,38.1 80.64,38.1 83.19,35.56 83.19,6.35 84.45,5.08 142.88,5.08 144.15,6.35 ULN1.6
D8
  Top 0.61: ULN1.7 146.69,5.08 145.41,3.81 83.19,3.81 81.92,5.08 81.92,34.29 79.38,36.83 53.98,36.83 52.7,38.1 PCB1.D8
D9
  Top 0.61: PCB1.D9 50.16,36.83 51.44,35.56 78.11,35.56 80.64,33.02 80.64,3.81 81.92,2.54 147.96,2.54 149.22,3.81 ULN1.8
D10
  Bottom 0.61: PCB1.D10 47.62,49.53 48.9,50.8 56.52,50.8 57.78,52.07 ULN2.8
D11
  Bottom 0.61: ULN2.7 55.24,54.61 52.7,52.07 46.35,52.07 45.09,50.8 PCB1.D11
D12
  Bottom 0.61: PCB1.D12 42.55,52.07 43.81,53.34 51.44,53.34 52.7,54.61 ULN2.6
DGND  (1 unrouted)
  Top 0.61: C16.2 106.81,22.86 C3.-
  Bottom 0.61: C16.2 116.2,22.86 117.47,24.13 117.47,29.21 118.75,30.48 | 19.68,48.26 C15.2 17.14,40.64 U$4.A U$3.A | C1.- 19.68,48.26 | 19.68,48.26 30.48,48.26 IC1.GND
  pour Bottom: 116.2,41.91 172.09,41.91 172.09,29.21 116.2,29.21
GOUT
  Top 0.61: 33.66,100.33 32.38,101.6 28.57,101.6 27.3,102.87 27.3,105.41 X15.2 | X16.2 45.06,102.85 43.81,101.6 | X21.2 70.46,87.61 70.48,87.63
  Bottom 0.61: X20.2 36.17,87.61 36.2,87.63
  pour Top: 0.64,113.03 0.64,85.09 93.34,85.09 93.34,113.03
  pour Bottom: 0.64,113.03 93.34,113.03 93.34,85.09 0.64,85.09
L+1
  Bottom 0.61: X9.1 147.93,101.62 K5.9
L+2
  Bottom 0.61: X10.1 164.44,101.62 K6.9
L+3
  Bottom 0.61: X12.1 180.95,101.62 K8.9
L+IN
  Top 0.61: KBPL.9 175.9,64.77 167,73.66 X14.3 156.87,76.18 151.76,81.28 151.76,92.71 K5.11 151.76,97.79 163.19,97.79 K6.11 168.28,97.79 179.71,97.79 K8.11
  Bottom 0.61: X14.3 164.49,74.91 164.44,74.91 159.38,69.85 159.38,62.23 158.12,60.96 U3.3
L-1
  Bottom 0.61: X9.3 158.09,101.58 K5.8
L-2
  Bottom 0.61: K6.8 174.62,101.6 174.62,106.68 X10.3
L-3
  Bottom 0.61: X12.3 191.11,101.58 K8.8
L-IN
  Top 0.61: K5.6 161.93,95.25 164.47,92.71 167,92.71 169.54,95.25 K6.6 178.44,95.25 180.97,92.71 187.32,92.71 | 187.32,92.71 K8.6 | 187.32,92.71 187.32,90.17 183.51,86.36 179.71,86.36 175.9,82.55 175.9,80.01 174.62,78.74 174.62,76.2 X14.1
  Bottom 0.61: U4.3 170.81,60.96 173.35,63.5 173.35,71.12 174.65,72.41 X14.1 174.67,76.2 | KBPL.8 183.51,71.12 178.44,76.2 174.67,76.2 | 174.67,76.2 174.62,76.2
LOUT+
  Top 0.61: K11.6 15.88,96.52 40.01,96.52 41.27,95.25 K2.11
  Bottom 0.61: K2.11 42.55,93.98 45.09,91.44 45.09,74.93 47.6,72.42 X21.1 65.38,74.91 67.94,77.47 71.75,77.47 74.3,80.01 74.3,92.71 75.56,93.98 K10.11
LOUT-
  Top 0.61: X21.3 75.54,76.22 73.03,78.74 73.03,95.25 71.75,96.52 50.16,96.52 48.9,95.25 K2.6
  Bottom 0.61: X21.3 79.4,72.42 81.92,74.93 81.92,92.71 83.19,93.98 K10.6
LPGA+
  Top 0.61: KBPL.13 175.9,49.53 183.51,41.91 183.51,34.29 180.97,31.75 177.16,31.75 175.9,33.02 175.9,35.56 X6.1
  Bottom 0.61: X6.1 168.28,43.18 156.84,43.18 154.31,45.72 IC4.14
LPGA-
  Bottom 0.61: IC4.11 161.93,46.99 163.19,45.72 172.09,45.72 177.16,40.64 180.98,40.64 X6.3 186.06,35.61 186.06,52.07 184.78,53.34 KBPL.4
N$1
  Bottom 0.61: U2.6 133.99,60.96 136.53,58.42 U2.2 141.6,55.88 141.6,50.8 IC3.9
N$2
  Bottom 0.61: U1.6 121.28,60.96 123.83,58.42 U1.2 127,58.42 128.27,57.15 128.27,53.98 125.09,50.8 122.56,50.8 121.28,49.53 IC3.16
N$3
  Bottom 0.61: U4.6 164.47,60.96 167,58.42 U4.2 170.81,58.42 171.45,57.78 171.45,53.98 167,49.53 IC4.9
N$5
  Bottom 0.61: U$1.C U$2.C 22.23,59.69 24.77,57.15 C1.+ 32.38,53.34 33.66,52.07 33.66,48.26 IC1.IN 32.38,45.72 29.84,43.18 C15.1
N$6
  Top 0.61: U$7.C U$5.A
  Bottom 0.61: X2.2 12.09,24.15 U$7.C
N$7
  Bottom 0.61: X2.1 9.5,29.23 10.79,27.94 15.88,27.94 U$6.A U$8.C
N$8
  Top 0.61: X1.1 14.63,50.82 U$2.A
  Bottom 0.61: U$4.C U$2.A
N$9
  Top 0.61: U$5.C U$6.C 18.41,36.83 20.95,34.29 C17.1 20.95,22.86 C2.+ 22.23,19.05 26.04,15.24 56.52,15.24 59.05,17.78 IC2.IN
N$10
  Top 0.61: X1.2 10.82,45.74 12.06,46.99 U$3.C
  Bottom 0.61: U$3.C U$1.A
N$15
  Bottom 0.61: U3.2 154.31,58.42 151.76,60.96 U3.6 147.96,60.96 146.69,59.69 146.69,52.07 149.22,49.53 IC4.16
N$17
  Bottom 0.61: OK1.2 R5.2
N$18
  Bottom 0.61: R6.2 OK2.2
N$19
  Bottom 0.61: OK3.1 R7.2
N$20
  Bottom 0.61: OK3.3 R8.2
N$21
  Bottom 0.61: ULN1.14 141.6,19.05 139.06,21.59 132.72,21.59 OK1.3
N$22
  Bottom 0.61: ULN1.12 146.69,22.86 150.5,26.67 153.03,26.67 OK3.2
N$23
  Bottom 0.61: OK3.4 160.66,25.4 161.93,24.13 161.93,16.51 160.66,15.24 150.5,15.24 149.22,16.51 ULN1.11
N$24
  Bottom 0.61: X15.3 32.36,100.31 K1.8
N$25
  Bottom 0.61: ULN1.13 OK2.3
N$26
  Bottom 0.61: X15.1 22.2,100.35 K1.9
N$27
  Bottom 0.61: X16.1 39.98,100.35 K2.9
N$28
  Bottom 0.61: X16.3 50.14,100.31 K2.8
N$29
  Bottom 0.61: X17.1 57.76,100.35 K9.9
N$30
  Bottom 0.61: X17.3 67.92,100.31 K9.8
N$31
  Bottom 0.61: X18.1 75.54,100.35 K10.9
N$32
  Bottom 0.61: X18.3 85.7,100.31 K10.8
N$33
  Bottom 0.61: X19.1 4.42,100.35 K11.9
N$34
  Bottom 0.61: X19.3 14.58,100.31 K11.8
OUT1
  Top 0.61: ULN2.13 52.7,64.77 51.44,66.04 28.57,66.04 27.3,67.31 27.3,80.01 28.57,81.28 K1.1 31.11,82.55 32.38,83.82 47.62,83.82 48.9,82.55 K2.1
OUT2
  Top 0.61: K10.1 84.45,73.66 80.64,69.85 62.87,69.85 | 62.87,69.85 57.78,69.85 55.24,67.31 ULN2.12 | K9.1 62.87,77.47 62.87,69.85
OUT3
  Top 0.61: ULN2.11 57.78,62.23 56.52,60.96 31.11,60.96 13.34,78.74 K11.1
R+1
  Bottom 0.61: X3.1 98.4,101.62 K3.9
R+2
  Bottom 0.61: X5.1 114.91,101.62 K4.9
R+3
  Bottom 0.61: X11.1 131.42,101.62 K7.9
R+IN
  Top 0.61: K7.11 130.18,97.79 118.75,97.79 K4.11 113.67,97.79 102.23,97.79 K3.11 99.69,92.71 102.23,90.17 102.23,87.63 103.5,86.36 107.31,86.36 114.96,78.72 X13.3
  Bottom 0.61: KBPR.9 106.05,71.12 111.1,76.18 X13.3 114.96,69.87 114.94,69.85 123.83,60.96 U1.3
R-1
  Bottom 0.61: K3.8 108.58,101.6 108.58,106.68 X3.3
R-2
  Bottom 0.61: K4.8 125.09,101.6 125.09,106.68 X5.3
R-3
  Bottom 0.61: X11.3 141.58,101.58 K7.8
R-IN
  Top 0.61: X13.1 125.07,76.18 | KBPR.8 113.67,64.77 113.71,64.77 X13.1 | K3.6 113.67,95.25 116.2,92.71 117.47,92.71 120.02,95.25 K4.6 128.91,95.25 131.44,92.71 137.79,92.71 | 137.79,92.71 K7.6 | 137.79,92.71 136.53,91.44 136.53,81.28 131.42,76.18 X13.1
  Bottom 0.61: X13.1 131.44,69.85 131.44,66.04 136.53,60.96 U2.3
ROUT+
  Top 0.61: K9.11 56.52,93.98 55.24,92.71 55.24,71.12 53.98,69.85 32.38,69.85 31.11,71.12 31.11,72.39 X20.1
  Bottom 0.61: X20.1 23.5,72.42 | K1.11 20.95,91.44 20.95,74.93 23.47,72.42 23.5,72.42 | K11.11 3.17,91.44 3.17,74.93 5.71,72.39 23.47,72.39 23.5,72.42
ROUT-
  Bottom 0.61: X20.3 41.25,73.68 38.73,76.2 38.73,92.71 37.47,93.98 K1.6 31.11,95.25 32.38,96.52 64.14,96.52 K9.6
RPGA+
  Top 0.61: 103.5,35.56 | 103.5,35.56 X7.1 | 103.5,35.56 103.5,50.8 KBPR.13
  Bottom 0.61: IC3.14 126.36,46.99 125.09,45.72 116.2,45.72 113.67,43.18 111.08,43.18 X7.1
RPGA-
  Top 0.61: KBPR.4 113.67,48.26 106.05,40.64 106.05,34.29 107.31,33.02 112.39,33.02 113.67,34.29 113.67,35.56 X7.3
  Bottom 0.61: IC3.11 133.99,45.72 132.72,44.45 122.56,44.45 121.28,43.18 117.47,43.18 114.94,40.64 114.94,36.88 X7.3
SCLK
  Bottom 0.61: IC4.6 161.93,31.75 160.66,30.48 145.41,30.48 144.15,31.75 OK2.6 144.15,34.29 R10.2 145.41,36.2 142.88,38.73 134.62,38.73 133.99,39.37 IC3.6
SDATA
  Top 0.61: R9.2 OK1.6
  Bottom 0.61: IC4.3 151.76,43.18 127.64,43.18 126.36,41.91 IC3.3 126.36,39.37 128.91,36.83 R9.2 131.44,35.56 132.72,36.83
SEL1
  Bottom 0.61: ULN1.17 133.99,16.51 132.72,15.24 106.05,15.24 98.42,22.86 98.42,77.47 103.5,82.55 K3.1 107.31,81.28 109.86,78.74 130.18,78.74 132.72,76.2 153.03,76.2 156.84,80.01 K5.1
SEL2
  Bottom 0.61: K6.1 173.35,85.09 | 173.35,85.09 172.09,86.36 144.15,86.36 142.88,85.09 142.88,80.01 140.34,77.47 132.72,77.47 127.64,82.55 K4.1 | ULN1.16 136.53,15.24 139.06,12.7 189.87,12.7 193.68,16.51 193.68,83.82 192.41,85.09 173.35,85.09
SEL3
  Bottom 0.61: K8.1 191.13,82.55 192.41,81.28 192.41,16.51 189.87,13.97 140.34,13.97 139.06,15.24 ULN1.15 139.06,19.05 137.79,20.32 136.53,20.32 135.25,19.05 135.25,15.24 133.99,13.97 106.05,13.97 97.16,22.86 97.16,86.36 98.42,87.63 137.79,87.63 140.34,85.09 K7.1